# EasyEDA schematic 1-Schematic_Seven Lions.json
TITLE: New Schematic; REV: 1.0; Date: 2017-10-16; Sheet: 1/1; Drawn By: jamesvictorpae
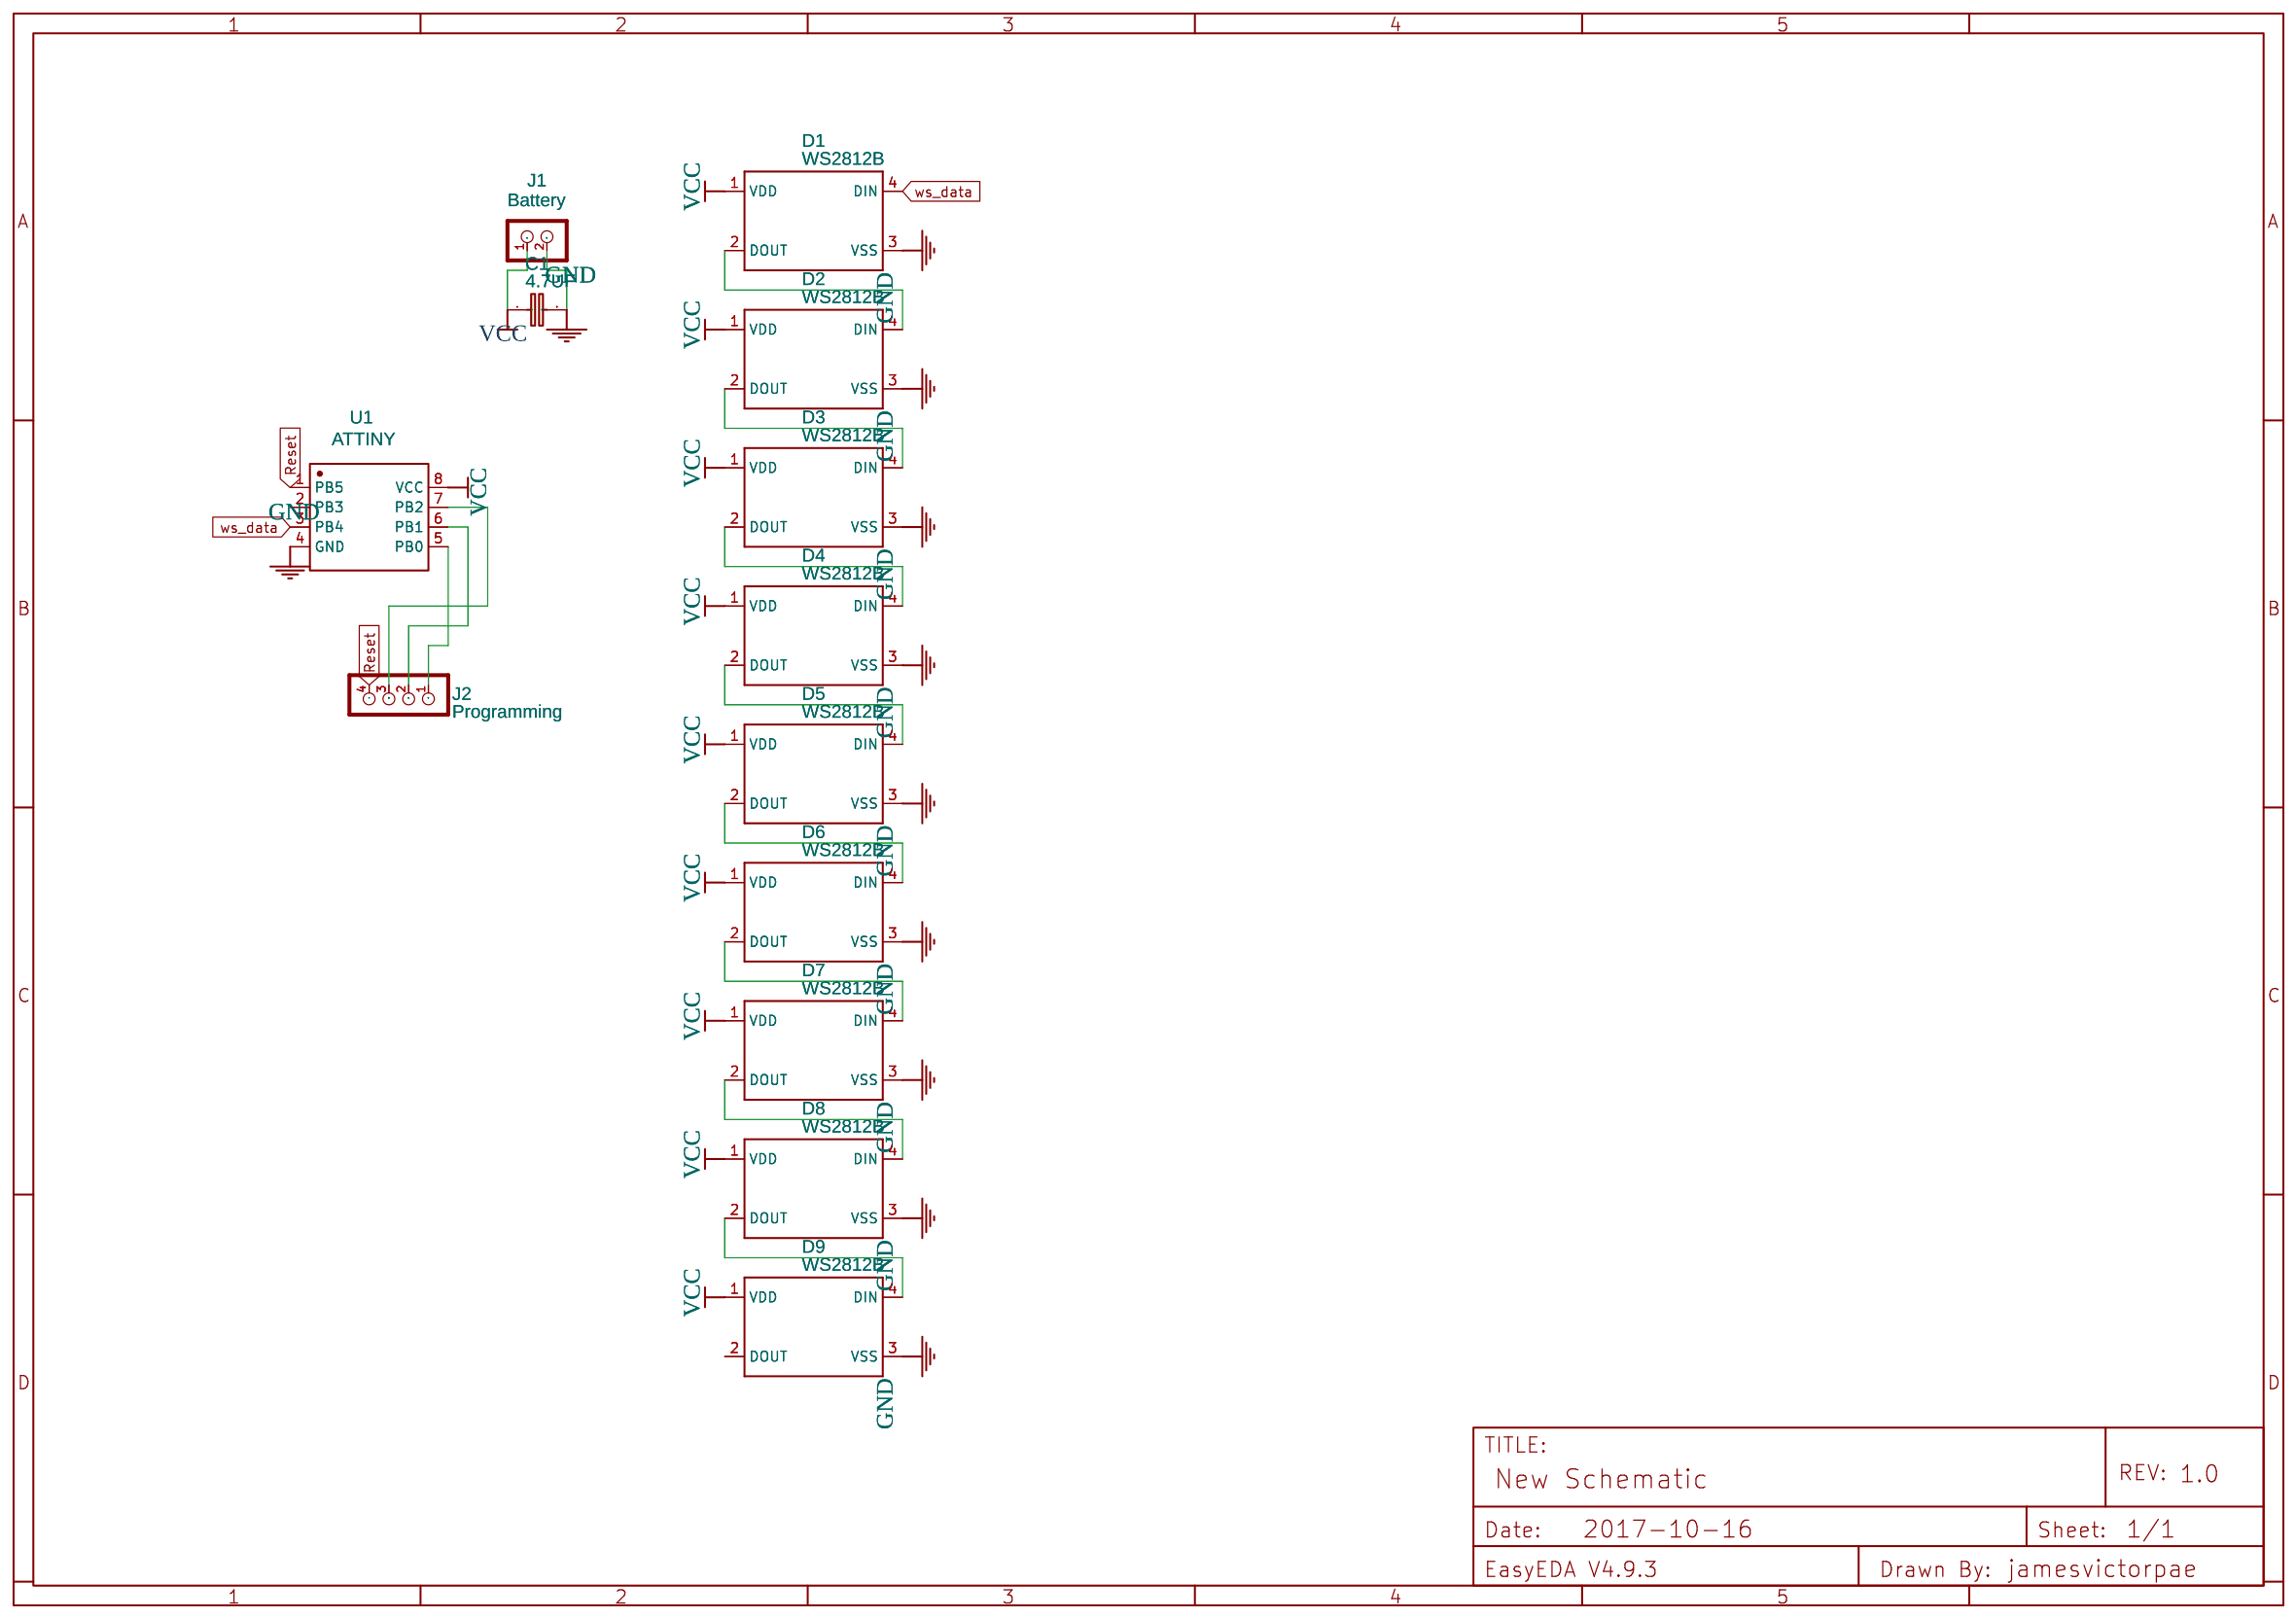
[diagram p0: schematic sheet]

## Parts
C1  4.7UF  [C1206]
D1  WS2812B  [WS2812B]
D2  WS2812B  [WS2812B]
D3  WS2812B  [WS2812B]
D4  WS2812B  [WS2812B]
D5  WS2812B  [WS2812B]
D6  WS2812B  [WS2812B]
D7  WS2812B  [WS2812B]
D8  WS2812B  [WS2812B]
D9  WS2812B  [WS2812B]
J1  Battery  [M1X2]
J2  Programming  [M1X4]
U1  ATTINY  [SOIC-8_208MIL]

## Library data of the parts
C1 = -: Non-Polarized capacitor in various packages; catid: 20; Contributor: DangerousPrototype; Manufacturer Part: ?
D1-D9 = -: catid: 20; Contributor: SparkFun; Manufacturer Part: ?
J1 J2 = -: catid: 20; Contributor: DangerousPrototype; Manufacturer Part: ?
U1 = -: Supplier: LCSC; Manufacturer: ATMEL; Manufacturer Part: ATTINY85-20SU; LCSC: C89852

## Nets
GND: C1.2 D1.3(VSS) D2.3(VSS) D3.3(VSS) D4.3(VSS) D5.3(VSS) D6.3(VSS) D7.3(VSS) D8.3(VSS) D9.3(VSS) J1.2 U1.4(GND)
VCC: C1.1 D1.1(VDD) D2.1(VDD) D3.1(VDD) D4.1(VDD) D5.1(VDD) D6.1(VDD) D7.1(VDD) D8.1(VDD) D9.1(VDD) J1.1 U1.8(VCC)
Reset: J2.4 U1.1(PB5)
ws_data: D1.4(DIN) U1.3(PB4)
Net-(D1-2): D1.2(DOUT) D2.4(DIN)
Net-(D2-2): D2.2(DOUT) D3.4(DIN)
Net-(D3-2): D3.2(DOUT) D4.4(DIN)
Net-(D4-2): D4.2(DOUT) D5.4(DIN)
Net-(D5-2): D5.2(DOUT) D6.4(DIN)
Net-(D6-2): D6.2(DOUT) D7.4(DIN)
Net-(D7-2): D7.2(DOUT) D8.4(DIN)
Net-(D8-2): D8.2(DOUT) D9.4(DIN)
Net-(J2-1): J2.1 U1.5(PB0)
Net-(J2-2): J2.2 U1.6(PB1)
Net-(J2-3): J2.3 U1.7(PB2)

Not connected (* = marked no-connect by the designer): D9 2(DOUT); U1 2(PB3)
